# EAGLE design xen_teensy_controls_template (EAGLE 9.6.0)
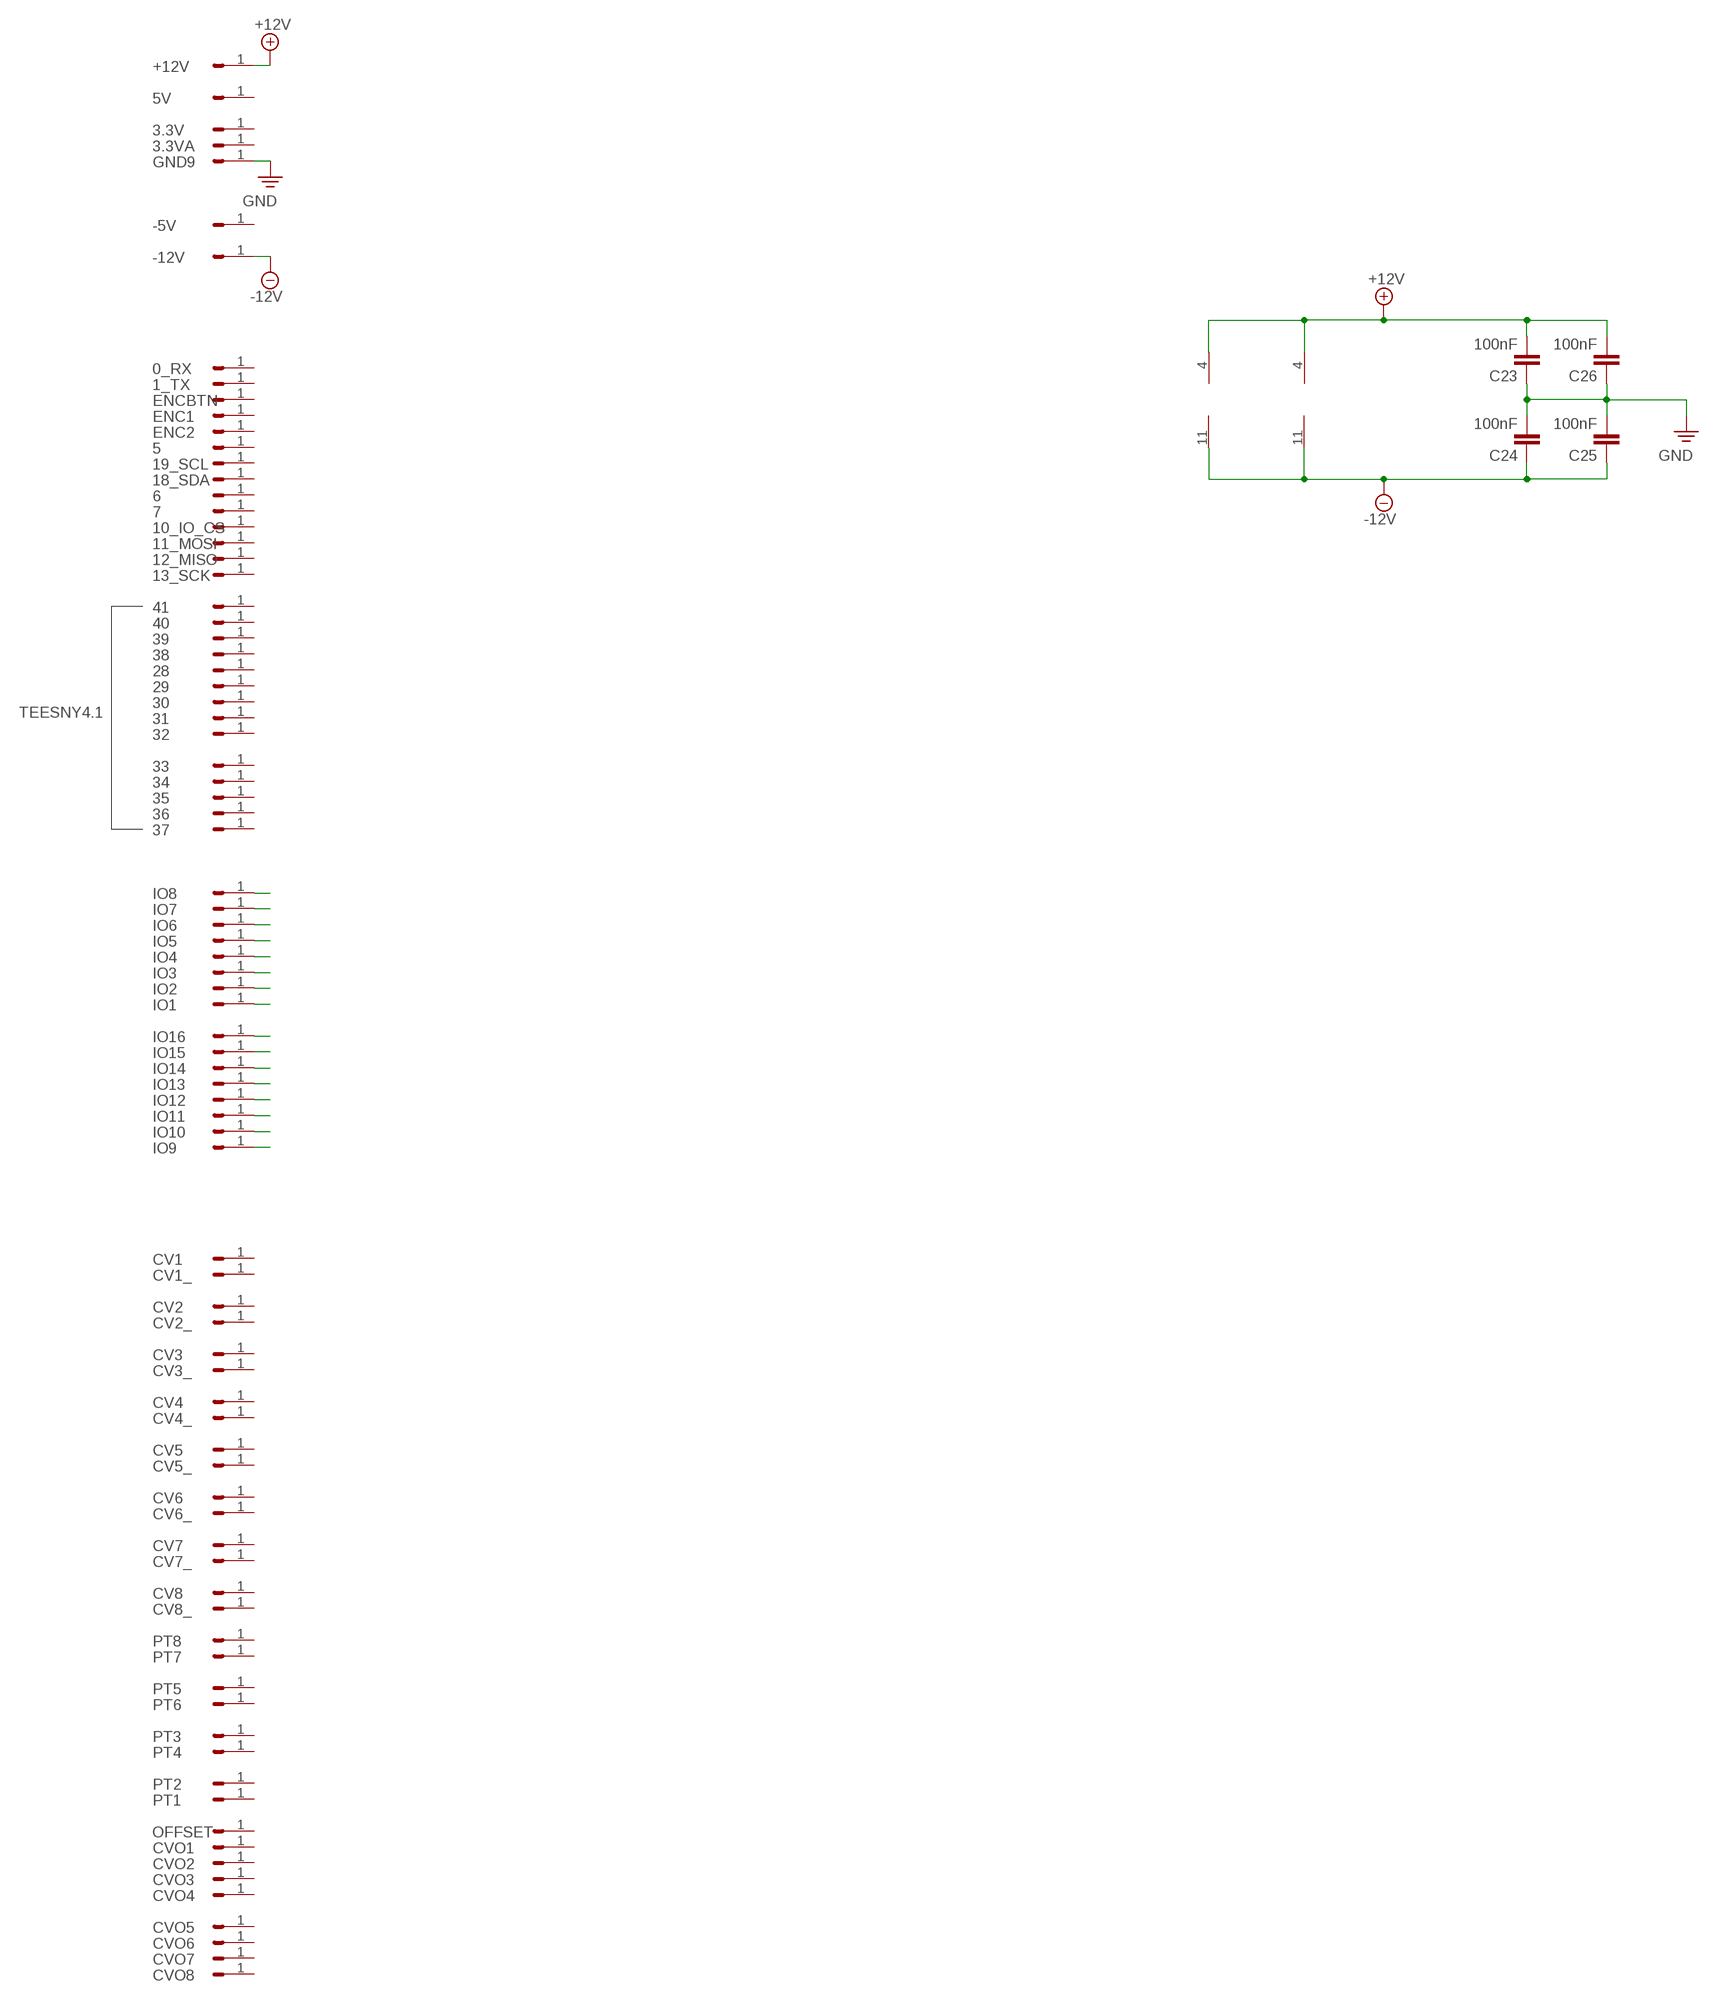
[diagram p0: schematic, sheet 1]

## Parts
0_RX  HEADER/MALE/01  [HEADER/MALE/01]
1_TX  HEADER/MALE/01  [HEADER/MALE/01]
3.3V  HEADER/MALE/01  [HEADER/MALE/01]
3.3VA  HEADER/MALE/01  [HEADER/MALE/01]
5  HEADER/MALE/01  [HEADER/MALE/01]
5V  HEADER/MALE/01  [HEADER/MALE/01]
6  HEADER/MALE/01  [HEADER/MALE/01]
7  HEADER/MALE/01  [HEADER/MALE/01]
10_IO_CS  HEADER/MALE/01  [HEADER/MALE/01]
11_MOSI  HEADER/MALE/01  [HEADER/MALE/01]
12_MISO  HEADER/MALE/01  [HEADER/MALE/01]
13_SCK  HEADER/MALE/01  [HEADER/MALE/01]
18_SDA  HEADER/MALE/01  [HEADER/MALE/01]
19_SCL  HEADER/MALE/01  [HEADER/MALE/01]
28  HEADER/MALE/01  [HEADER/MALE/01]
29  HEADER/MALE/01  [HEADER/MALE/01]
30  HEADER/MALE/01  [HEADER/MALE/01]
31  HEADER/MALE/01  [HEADER/MALE/01]
32  HEADER/MALE/01  [HEADER/MALE/01]
33  HEADER/MALE/01  [HEADER/MALE/01]
34  HEADER/MALE/01  [HEADER/MALE/01]
35  HEADER/MALE/01  [HEADER/MALE/01]
36  HEADER/MALE/01  [HEADER/MALE/01]
37  HEADER/MALE/01  [HEADER/MALE/01]
38  HEADER/MALE/01  [HEADER/MALE/01]
39  HEADER/MALE/01  [HEADER/MALE/01]
40  HEADER/MALE/01  [HEADER/MALE/01]
41  HEADER/MALE/01  [HEADER/MALE/01]
+12V  HEADER/MALE/01  [HEADER/MALE/01]
-5V  HEADER/MALE/01  [HEADER/MALE/01]
-12V  HEADER/MALE/01  [HEADER/MALE/01]
C23  100nF  CAPACITORC0603  [C0603]
C24  100nF  CAPACITORC0603  [C0603]
C25  100nF  CAPACITORC0603  [C0603]
C26  100nF  CAPACITORC0603  [C0603]
CV1  HEADER/MALE/01  [HEADER/MALE/01]
CV1_  HEADER/MALE/01  [HEADER/MALE/01]
CV2  HEADER/MALE/01  [HEADER/MALE/01]
CV2_  HEADER/MALE/01  [HEADER/MALE/01]
CV3  HEADER/MALE/01  [HEADER/MALE/01]
CV3_  HEADER/MALE/01  [HEADER/MALE/01]
CV4  HEADER/MALE/01  [HEADER/MALE/01]
CV4_  HEADER/MALE/01  [HEADER/MALE/01]
CV5  HEADER/MALE/01  [HEADER/MALE/01]
CV5_  HEADER/MALE/01  [HEADER/MALE/01]
CV6  HEADER/MALE/01  [HEADER/MALE/01]
CV6_  HEADER/MALE/01  [HEADER/MALE/01]
CV7  HEADER/MALE/01  [HEADER/MALE/01]
CV7_  HEADER/MALE/01  [HEADER/MALE/01]
CV8  HEADER/MALE/01  [HEADER/MALE/01]
CV8_  HEADER/MALE/01  [HEADER/MALE/01]
CVO1  HEADER/MALE/01  [HEADER/MALE/01]
CVO2  HEADER/MALE/01  [HEADER/MALE/01]
CVO3  HEADER/MALE/01  [HEADER/MALE/01]
CVO4  HEADER/MALE/01  [HEADER/MALE/01]
CVO5  HEADER/MALE/01  [HEADER/MALE/01]
CVO6  HEADER/MALE/01  [HEADER/MALE/01]
CVO7  HEADER/MALE/01  [HEADER/MALE/01]
CVO8  HEADER/MALE/01  [HEADER/MALE/01]
ENC1  HEADER/MALE/01  [HEADER/MALE/01]
ENC2  HEADER/MALE/01  [HEADER/MALE/01]
ENCBTN  HEADER/MALE/01  [HEADER/MALE/01]
GND9  HEADER/MALE/01  [HEADER/MALE/01]
IC1  TL074D  [SO14]
IC5  TL074D  [SO14]
IO1  HEADER/MALE/01  [HEADER/MALE/01]
IO2  HEADER/MALE/01  [HEADER/MALE/01]
IO3  HEADER/MALE/01  [HEADER/MALE/01]
IO4  HEADER/MALE/01  [HEADER/MALE/01]
IO5  HEADER/MALE/01  [HEADER/MALE/01]
IO6  HEADER/MALE/01  [HEADER/MALE/01]
IO7  HEADER/MALE/01  [HEADER/MALE/01]
IO8  HEADER/MALE/01  [HEADER/MALE/01]
IO9  HEADER/MALE/01  [HEADER/MALE/01]
IO10  HEADER/MALE/01  [HEADER/MALE/01]
IO11  HEADER/MALE/01  [HEADER/MALE/01]
IO12  HEADER/MALE/01  [HEADER/MALE/01]
IO13  HEADER/MALE/01  [HEADER/MALE/01]
IO14  HEADER/MALE/01  [HEADER/MALE/01]
IO15  HEADER/MALE/01  [HEADER/MALE/01]
IO16  HEADER/MALE/01  [HEADER/MALE/01]
OFFSET  HEADER/MALE/01  [HEADER/MALE/01]
PT1  HEADER/MALE/01  [HEADER/MALE/01]
PT2  HEADER/MALE/01  [HEADER/MALE/01]
PT3  HEADER/MALE/01  [HEADER/MALE/01]
PT4  HEADER/MALE/01  [HEADER/MALE/01]
PT5  HEADER/MALE/01  [HEADER/MALE/01]
PT6  HEADER/MALE/01  [HEADER/MALE/01]
PT7  HEADER/MALE/01  [HEADER/MALE/01]
PT8  HEADER/MALE/01  [HEADER/MALE/01]

## Nets
+12V: +12V.1 C23.2 C26.2 IC1.4(P:V+) IC5.4(P:V+)
-12V: -12V.1 C24.1 C25.1 IC1.11(P:V-) IC5.11(P:V-)
N$85: IO1.1
N$86: IO2.1
N$87: IO3.1
N$88: IO4.1
N$89: IO5.1
N$90: IO6.1
N$91: IO7.1
N$92: IO8.1
N$93: IO9.1
N$94: IO10.1
N$95: IO11.1
N$96: IO12.1
N$97: IO13.1
N$98: IO14.1
N$99: IO15.1
N$100: IO16.1
PE: C23.1 C24.2 C25.2 C26.1 GND9.1 ; supply symbol labelled GND
Unconnected: 0_RX.1 1_TX.1 3.3V.1 3.3VA.1 5.1 5V.1 6.1 7.1 10_IO_CS.1 11_MOSI.1 12_MISO.1 13_SCK.1 18_SDA.1 19_SCL.1 28.1 29.1 30.1 31.1 32.1 33.1 34.1 35.1 36.1 37.1 38.1 39.1 40.1 41.1 -5V.1 CV1.1 CV1_.1 CV2.1 CV2_.1 CV3.1 CV3_.1 CV4.1 CV4_.1 CV5.1 CV5_.1 CV6.1 CV6_.1 CV7.1 CV7_.1 CV8.1 CV8_.1 CVO1.1 CVO2.1 CVO3.1 CVO4.1 CVO5.1 CVO6.1 CVO7.1 CVO8.1 ENC1.1 ENC2.1 ENCBTN.1 IC1.1(A:OUT) IC1.2(A:-IN) IC1.3(A:+IN) IC1.5(B:+IN) IC1.6(B:-IN) IC1.7(B:OUT) IC1.8(C:OUT) IC1.9(C:-IN) IC1.10(C:+IN) IC1.12(D:+IN) IC1.13(D:-IN) IC1.14(D:OUT) IC5.1(A:OUT) IC5.2(A:-IN) IC5.3(A:+IN) IC5.5(B:+IN) IC5.6(B:-IN) IC5.7(B:OUT) IC5.8(C:OUT) IC5.9(C:-IN) IC5.10(C:+IN) IC5.12(D:+IN) IC5.13(D:-IN) IC5.14(D:OUT) OFFSET.1 PT1.1 PT2.1 PT3.1 PT4.1 PT5.1 PT6.1 PT7.1 PT8.1

## Notes on the sheet
- TEESNY4.1

## Library data of the parts
0_RX 1_TX 3.3V 3.3VA 5 5V 6 7 10_IO_CS 11_MOSI 12_MISO 13_SCK 18_SDA 19_SCL 28-41 +12V -5V -12V CV1 CV1_ CV2 CV2_ CV3 CV3_ CV4 CV4_ CV5 CV5_ CV6 CV6_ CV7 CV7_ CV8 CV8_ CVO1-CVO8 ENC1 ENC2 ENCBTN GND9 IO1-IO16 OFFSET PT1-PT8 = connectors:HEADER/MALE/01; SPICEPREFIX: X
C23-C26 = capacitors:CAPACITOR: CAPACITOR, European symbol
IC1 IC5 = ic_analogue:TL074: OP AMP

## Board
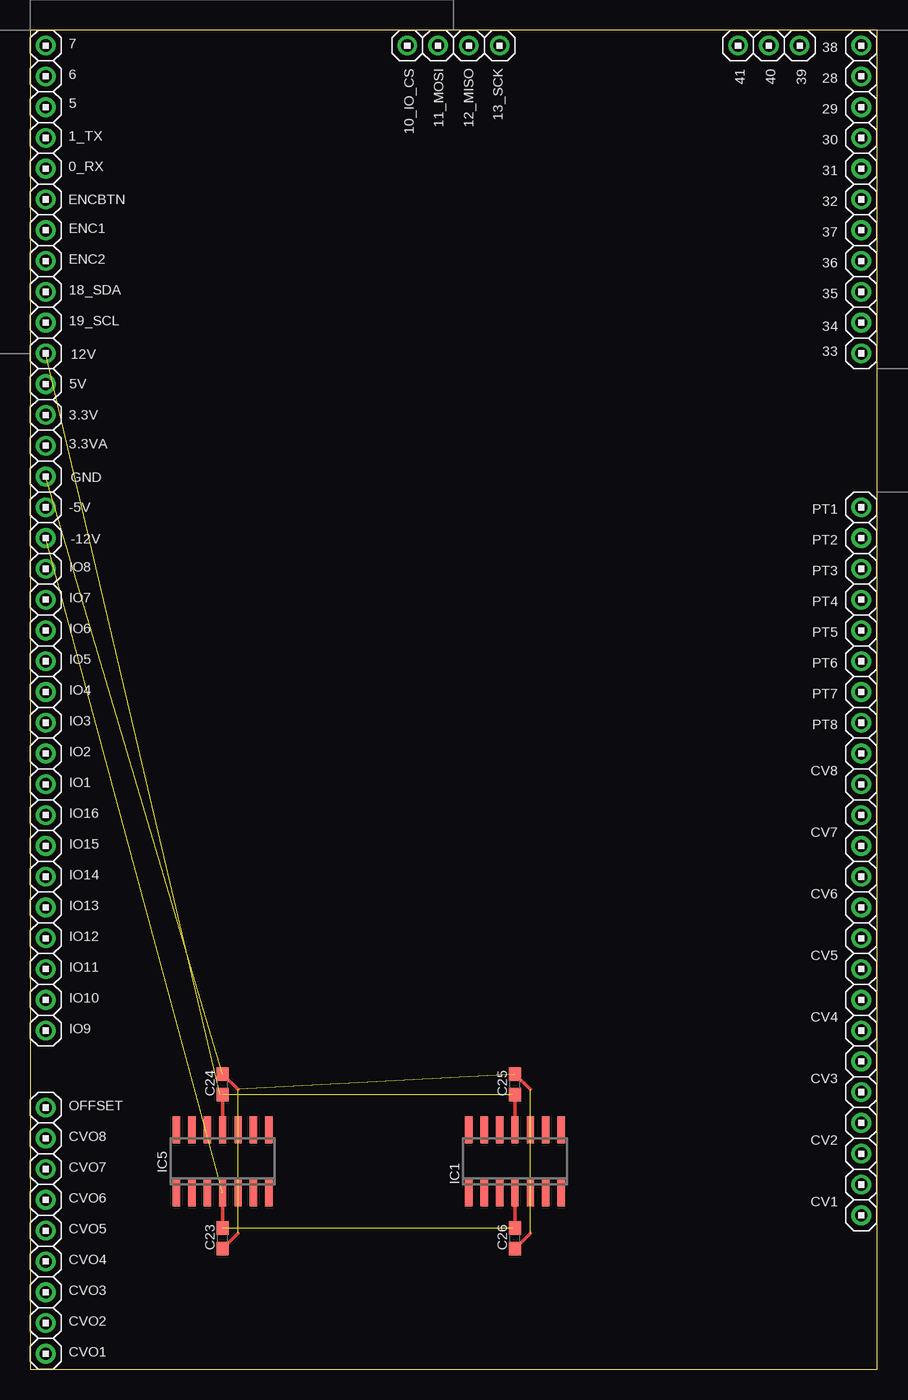
[diagram p1: board, top side]
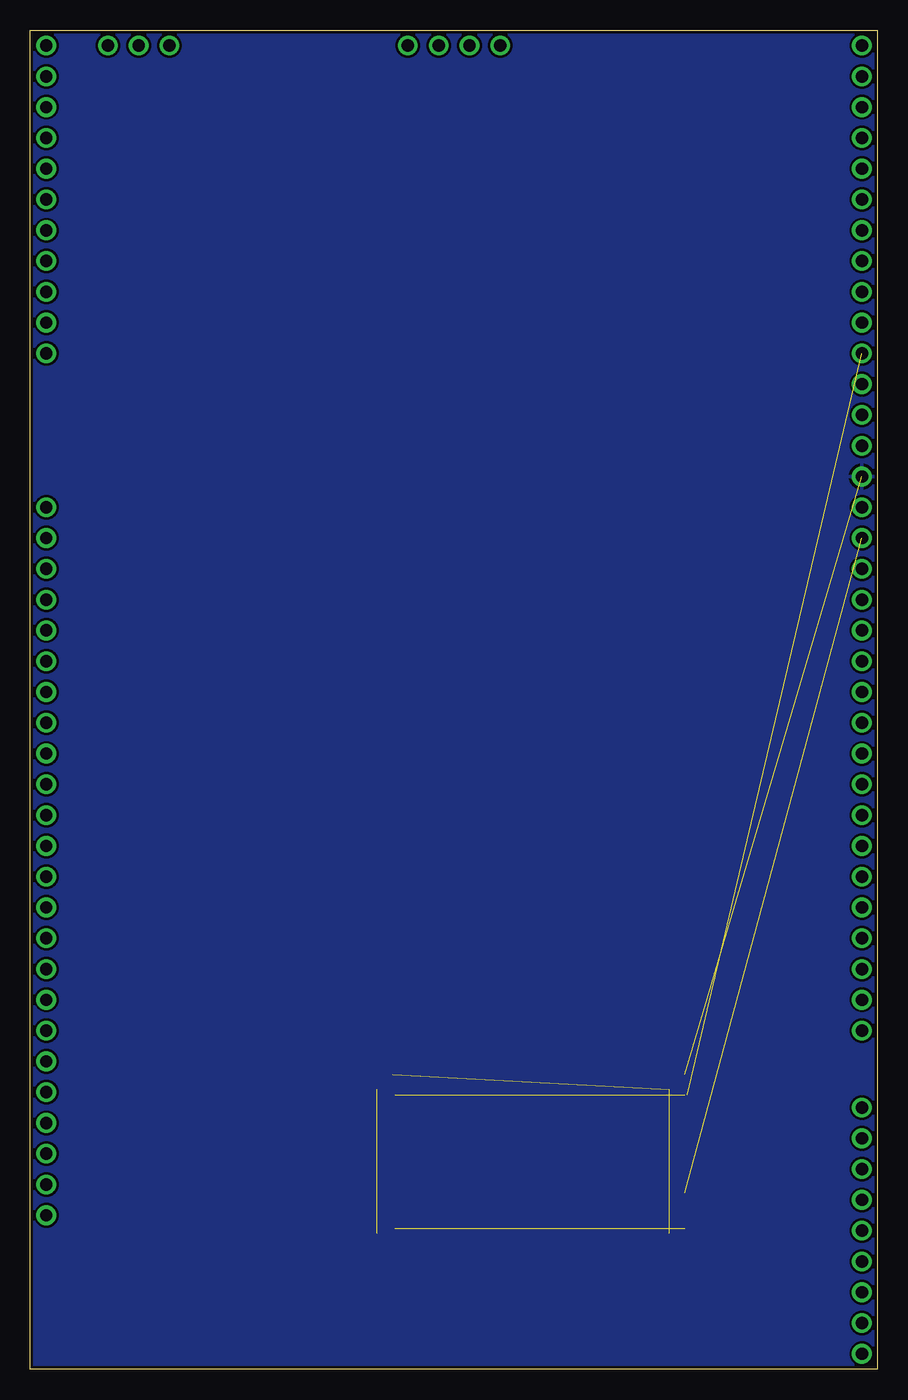
[diagram p2: board, bottom side, seen from below]

Size 69.9 x 110.48 mm. Coordinates in mm from the lower left corner, seen from the top.
Outline: 0,0 69.9,0 69.9,110.48 0,110.48 0,0
Copper layers (1*16): Top 0.0356mm / dielectric 1.5011mm / Bottom 0.0356mm
Design rules "pigatron *": minimum track width 8mil, minimum drill 13mil, track to track 8mil, track to pad 8mil, pad to pad 8mil, via to via 8mil, smd to smd 6mil, copper to edge 10mil, drill to drill 10mil, minimum pad ring 12mil, minimum via ring 10mil, stop-mask expansion 4mil, vias tented up to drill 0mil, thermal gap 10mil

### Footprints (pad centres in the part's own frame; a part is rotated, then mirrored left to right if it is on the bottom)
HEADER/MALE/01 = drill 1.016: 1 0,0
C0603 = smd 1.1 x 1: 1 -0.85,0; 2 0.85,0
SO14 = smd 0.6 x 2.2: 1 -3.81,-2.6; 2 -2.54,-2.6; 3 -1.27,-2.6; 4 0,-2.6; 5 1.27,-2.6; 6 2.54,-2.6; 7 3.81,-2.6; 8 3.81,2.6; 9 2.54,2.6; 10 1.27,2.6; 11 0,2.6; 12 -1.27,2.6; 13 -2.54,2.6; 14 -3.81,2.6

### Placement (x,y rotation side)
0_RX  1.27,99.06 0 top
1_TX  1.27,101.6 0 top
3.3V  1.27,78.74 90 top
3.3VA  1.27,76.2 0 top
5  1.27,104.14 0 top
5V  1.27,81.28 180 top
6  1.27,106.68 0 top
7  1.27,109.22 0 top
10_IO_CS  31.11,109.22 270 top
11_MOSI  33.66,109.22 270 top
12_MISO  36.2,109.22 270 top
13_SCK  38.73,109.22 270 top
18_SDA  1.27,88.9 0 top
19_SCL  1.27,86.36 0 top
28  68.58,106.68 180 top
29  68.58,104.14 180 top
30  68.58,101.6 180 top
31  68.58,99.06 180 top
32  68.58,96.52 180 top
33  68.58,83.82 180 top
34  68.58,86.36 180 top
35  68.58,88.9 180 top
36  68.58,91.44 180 top
37  68.58,93.98 180 top
38  68.58,109.22 180 top
39  63.5,109.22 270 top
40  60.96,109.22 270 top
41  58.42,109.22 270 top
+12V  1.27,68.58 0 top
-5V  1.27,71.12 0 top
-12V  1.27,83.82 0 top
C23  15.88,10.79 90 top
C24  15.88,23.5 90 top
C25  40.01,23.5 90 top
C26  40.01,10.79 90 top
CV1  68.58,15.24 0 top
CV1_  68.58,12.7 0 top
CV2  68.58,20.32 0 top
CV2_  68.58,17.78 0 top
CV3  68.58,25.4 0 top
CV3_  68.58,22.86 0 top
CV4  68.58,27.94 0 top
CV4_  68.58,30.48 0 top
CV5  68.58,33.02 180 top
CV5_  68.58,35.56 180 top
CV6  68.58,40.64 180 top
CV6_  68.58,38.1 180 top
CV7  68.58,43.18 180 top
CV7_  68.58,45.72 180 top
CV8  68.58,50.8 180 top
CV8_  68.58,48.26 180 top
CVO1  1.27,1.27 0 top
CVO2  1.27,3.81 0 top
CVO3  1.27,6.35 0 top
CVO4  1.27,8.89 0 top
CVO5  1.27,11.43 0 top
CVO6  1.27,13.97 0 top
CVO7  1.27,16.51 0 top
CVO8  1.27,19.05 0 top
ENC1  1.27,93.98 0 top
ENC2  1.27,91.44 0 top
ENCBTN  1.27,96.52 0 top
GND9  1.27,73.66 0 top
IC1  40.01,17.14 0 top
IC5  15.88,17.14 0 top
IO1  1.27,48.26 180 top
IO2  1.27,50.8 180 top
IO3  1.27,53.34 180 top
IO4  1.27,55.88 180 top
IO5  1.27,58.42 180 top
IO6  1.27,60.96 180 top
IO7  1.27,63.5 180 top
IO8  1.27,66.04 180 top
IO9  1.27,27.94 180 top
IO10  1.27,30.48 180 top
IO11  1.27,33.02 180 top
IO12  1.27,35.56 180 top
IO13  1.27,38.1 180 top
IO14  1.27,40.64 180 top
IO15  1.27,43.18 180 top
IO16  1.27,45.72 180 top
OFFSET  1.27,21.59 0 top
PT1  68.58,71.12 180 top
PT2  68.58,68.58 180 top
PT3  68.58,66.04 180 top
PT4  68.58,63.5 180 top
PT5  68.58,60.96 180 top
PT6  68.58,58.42 180 top
PT7  68.58,55.88 180 top
PT8  68.58,53.34 180 top
U$1  [PIGATRON-LOGO]  79.76,42.93 90 top  (outside the outline)

### Tracks (layer width: path | path; a pad name or v marks a point on that pad's centre or on a via)
+12V  (2 unrouted)
  Top 0.305: IC1.4 C26.2 39.79,11.64 | IC5.4 C23.2 15.66,11.64
-12V  (2 unrouted)
  Top 0.305: IC5.11 C24.1 15.66,22.64 | IC1.11 C25.1 39.79,22.64
PE  (4 unrouted)
  Top 0.305: C23.1 17.14,11.21 | C24.2 17.14,23.07 | C26.1 41.27,11.21 | 41.27,23.07 C25.2
  pour Bottom: 0,110.49 69.85,110.49 69.85,0 0,0

### Text on the board
tNames: 12V | GND | -12V | Rob Ellis 2021